# Altium schematic sheet Perco KT02.3.SchDoc
size 209 x 297 mm; Scale: 1:1; Letter1Column: Э
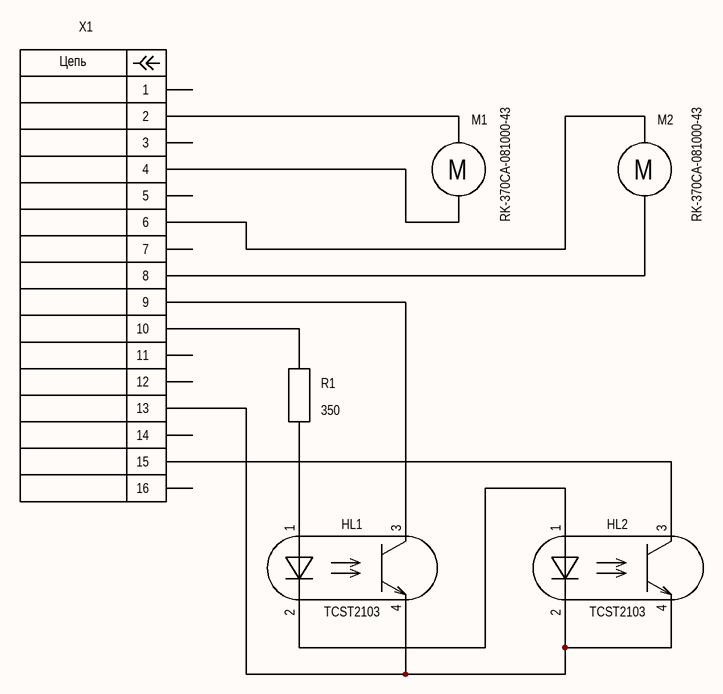
[diagram p0: Perco KT02.3.SchDoc]

## Parts
HL1  TCST2103  [214A67]
HL2  TCST2103  [214A67]
M1  RK-370CA-081000-43
M2  RK-370CA-081000-43
R1  350  [RESC1608N]
X1  302-S161  [IDC-16/2N]  (value not drawn)

## Nets
NetHL1_1: HL1.1(Anode) R1.2
NetHL1_2: HL1.2(Cathode) HL2.1(Anode)
NetHL1_3: HL1.3(Collector) X1.9
NetHL1_4: HL1.4(Emitter) HL2.2(Cathode) HL2.4(Emitter) X1.13
NetHL2_3: HL2.3(Collector) X1.15
NetM1_1: M1.1 X1.2
NetM1_2: M1.2 X1.4
NetM2_1: M2.1 X1.6
NetM2_2: M2.2 X1.8
NetR1_1: R1.1 X1.10

Not connected (* = marked no-connect by the designer): X1 1 3 5 7 11 12 14 16

## Notes on the sheet
- Перв. примен.
- Справ. №
- Подп. и дата
- Инв. № дубл.
- Взам. инв. №
- Разраб.
- Изм.
- Лист
- № докум.
- Подп.
- Дата
- Лит.
- Масса
- Масштаб
- Пров.
- Т.контр.
- Листов
- Инв. № подл.
- Утв.
- Н.контр.
- 2.106-A4
- Копировал
- Формат А4
- (in symbol 302-S161) Цепь
- (in symbol Default_1) M

## Library data of the parts
HL1 HL2 = TCST2103: Photointerrupter Barrier; Manufacturer: Fairchild Semiconductor; Group: Optical Sensors - Reflective; Part name: TCST2103; Package: TCST2103
M1 M2 = Default_1: Default; Operating temperature: -°C +°C; Mounting type: Surface mount; Dimension: .0mm x .0mm; Height: .0mm
R1 = RC0603JR-07330RL: RESC 330 0603(1608); Manufacturer: Yageo; Group: Discrete; Temperature coefficient: ±100ppm/°C; Tolerance: ±5%; Power: 0.1W; Value: 330; Component: Resiscot Ceramic; Part name: RC0603JR-07330RL; Type: Thin film; Package: 0603 (1608); Dimension: 1.60mm x 0.80mm; Height: 0.55mm; Operating temperature: -55°C +155°C; Mounting type: Surface mount
X1 = 302-S161: Connector Rectangular IDC M 16P 2R 2.54; Manufacturer: On Shore Technology; Group: Mechanical; Pitch: 2.54mm; Positions: 16; Rows: 2; Current rating: 3A; Voltage rating: 250V; Dimension: 28.00mm x 9.10mm; Operating temperature: -40°C +105°C; Mounting type: Through hole; Package: IDC-16/2; Part name: 302-S161; Height: 9.10mm; Insulation color: Black; Component: Connector Rectangular; Contact type: Male pin